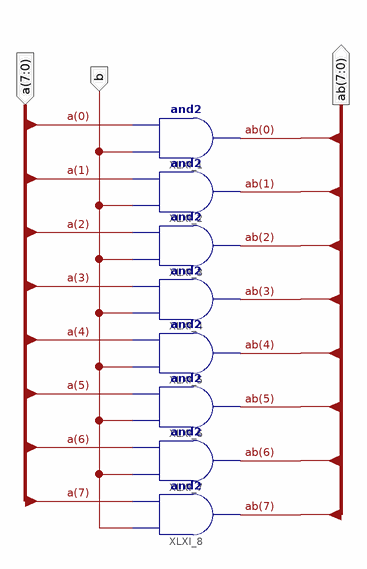
[diagram p0: schematic sheet 1]
// Xilinx ISE schematic extend_and_8bit.sch (spartan3e) as structural Verilog: 8 symbols, 3 ports
module extend_and_8bit (
  input  [7:0] a,
  input  b,
  output [7:0] ab
);

  and XLXI_1 (ab[0], b, a[0]);
  and XLXI_2 (ab[1], b, a[1]);
  and XLXI_3 (ab[2], b, a[2]);
  and XLXI_4 (ab[3], b, a[3]);
  and XLXI_5 (ab[4], b, a[4]);
  and XLXI_6 (ab[5], b, a[5]);
  and XLXI_7 (ab[6], b, a[6]);
  and XLXI_8 (ab[7], b, a[7]);
endmodule
